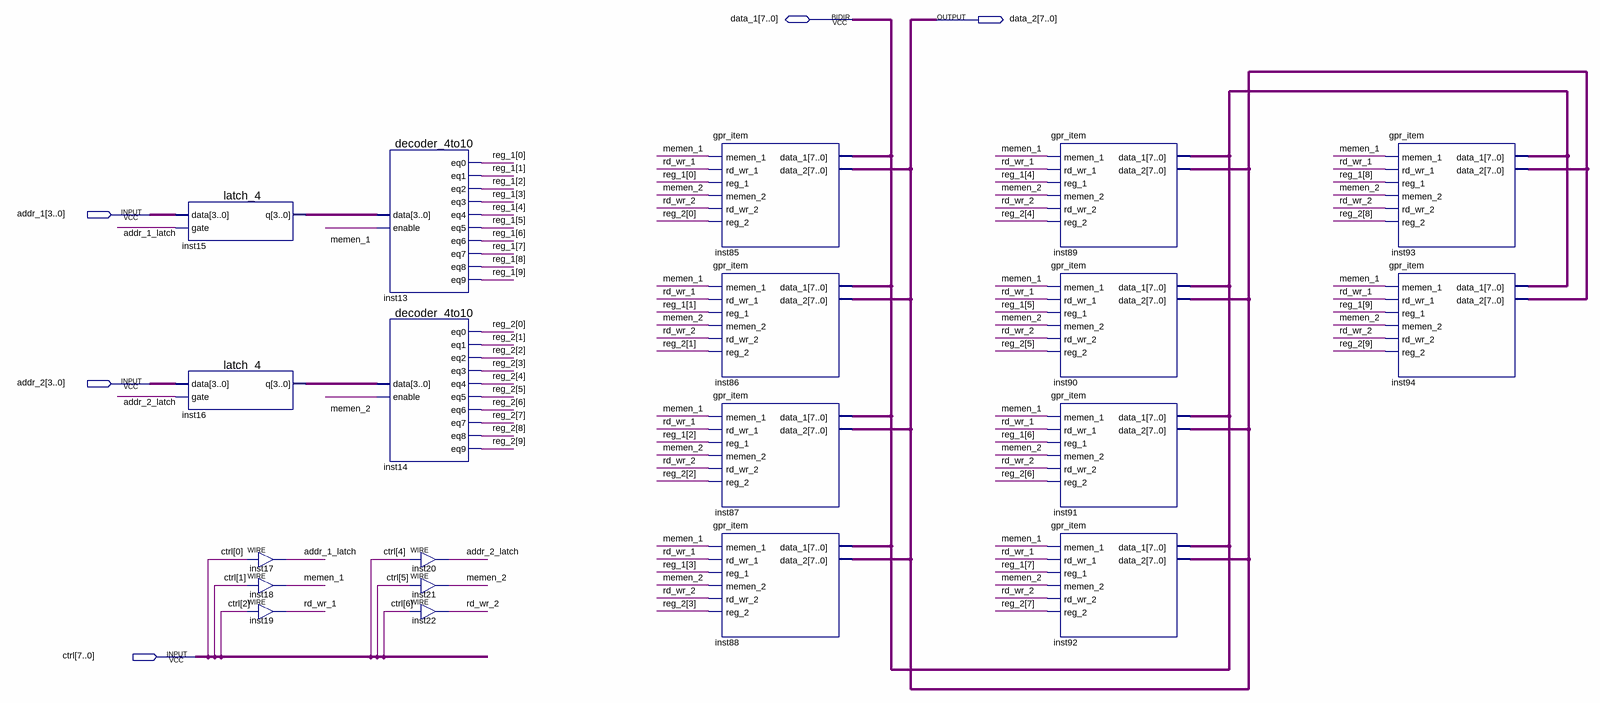
[diagram p0: schematic sheet]
// Quartus schematic gpr.bdf as structural Verilog: 20 symbols, 5 pins
module gpr (
  input  [3:0] addr_1,
  input  [3:0] addr_2,
  input  [7:0] ctrl,
  inout  [7:0] data_1,
  output [7:0] data_2
);

  wire addr_1_latch, addr_2_latch, memen_1, memen_2, rd_wr_1, rd_wr_2;
  wire [3:0] inst15_q, inst16_q;
  wire [9:0] reg_1, reg_2;

  latch_4 inst15 (.data(addr_1), .gate(addr_1_latch), .q(inst15_q));
  latch_4 inst16 (.data(addr_2), .gate(addr_2_latch), .q(inst16_q));
  assign addr_1_latch = ctrl[0];  // WIRE inst17
  assign memen_1 = ctrl[1];  // WIRE inst18
  assign rd_wr_1 = ctrl[2];  // WIRE inst19
  decoder_4to10 inst13 (
    .data(inst15_q), .enable(memen_1), .eq0(reg_1[0]), .eq1(reg_1[1]), .eq2(reg_1[2]), .eq3(reg_1[3]),
    .eq4(reg_1[4]), .eq5(reg_1[5]), .eq6(reg_1[6]), .eq7(reg_1[7]), .eq8(reg_1[8]), .eq9(reg_1[9]));
  decoder_4to10 inst14 (
    .data(inst16_q), .enable(memen_2), .eq0(reg_2[0]), .eq1(reg_2[1]), .eq2(reg_2[2]), .eq3(reg_2[3]),
    .eq4(reg_2[4]), .eq5(reg_2[5]), .eq6(reg_2[6]), .eq7(reg_2[7]), .eq8(reg_2[8]), .eq9(reg_2[9]));
  assign addr_2_latch = ctrl[4];  // WIRE inst20
  assign memen_2 = ctrl[5];  // WIRE inst21
  assign rd_wr_2 = ctrl[6];  // WIRE inst22
  gpr_item inst85 (
    .memen_1(memen_1), .rd_wr_1(rd_wr_1), .reg_1(reg_1[0]), .memen_2(memen_2), .rd_wr_2(rd_wr_2),
    .reg_2(reg_2[0]), .data_2(data_2), .data_1(data_1));
  gpr_item inst86 (
    .memen_1(memen_1), .rd_wr_1(rd_wr_1), .reg_1(reg_1[1]), .memen_2(memen_2), .rd_wr_2(rd_wr_2),
    .reg_2(reg_2[1]), .data_2(data_2), .data_1(data_1));
  gpr_item inst87 (
    .memen_1(memen_1), .rd_wr_1(rd_wr_1), .reg_1(reg_1[2]), .memen_2(memen_2), .rd_wr_2(rd_wr_2),
    .reg_2(reg_2[2]), .data_2(data_2), .data_1(data_1));
  gpr_item inst88 (
    .memen_1(memen_1), .rd_wr_1(rd_wr_1), .reg_1(reg_1[3]), .memen_2(memen_2), .rd_wr_2(rd_wr_2),
    .reg_2(reg_2[3]), .data_2(data_2), .data_1(data_1));
  gpr_item inst89 (
    .memen_1(memen_1), .rd_wr_1(rd_wr_1), .reg_1(reg_1[4]), .memen_2(memen_2), .rd_wr_2(rd_wr_2),
    .reg_2(reg_2[4]), .data_2(data_2), .data_1(data_1));
  gpr_item inst90 (
    .memen_1(memen_1), .rd_wr_1(rd_wr_1), .reg_1(reg_1[5]), .memen_2(memen_2), .rd_wr_2(rd_wr_2),
    .reg_2(reg_2[5]), .data_2(data_2), .data_1(data_1));
  gpr_item inst91 (
    .memen_1(memen_1), .rd_wr_1(rd_wr_1), .reg_1(reg_1[6]), .memen_2(memen_2), .rd_wr_2(rd_wr_2),
    .reg_2(reg_2[6]), .data_2(data_2), .data_1(data_1));
  gpr_item inst92 (
    .memen_1(memen_1), .rd_wr_1(rd_wr_1), .reg_1(reg_1[7]), .memen_2(memen_2), .rd_wr_2(rd_wr_2),
    .reg_2(reg_2[7]), .data_2(data_2), .data_1(data_1));
  gpr_item inst93 (
    .memen_1(memen_1), .rd_wr_1(rd_wr_1), .reg_1(reg_1[8]), .memen_2(memen_2), .rd_wr_2(rd_wr_2),
    .reg_2(reg_2[8]), .data_2(data_2), .data_1(data_1));
  gpr_item inst94 (
    .memen_1(memen_1), .rd_wr_1(rd_wr_1), .reg_1(reg_1[9]), .memen_2(memen_2), .rd_wr_2(rd_wr_2),
    .reg_2(reg_2[9]), .data_2(data_2), .data_1(data_1));
endmodule
